# Altium schematic sheet LMT01 Interface.schdoc
size A4
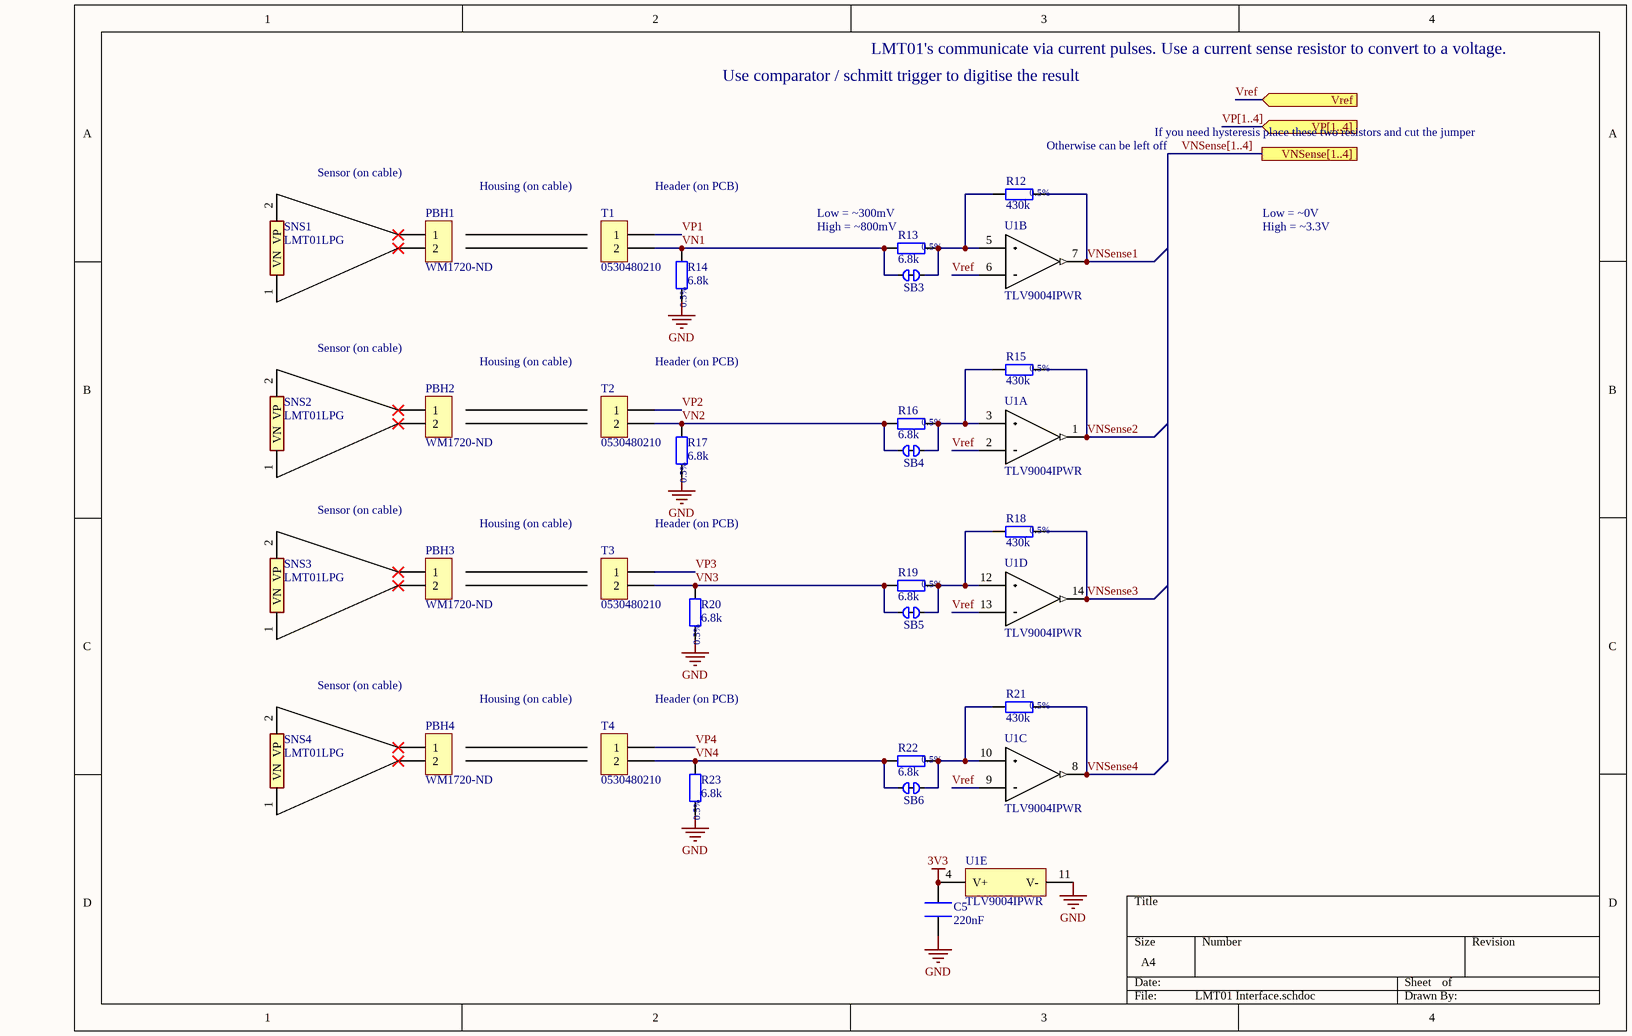
[diagram p0: LMT01 Interface.schdoc]

## Parts
C5  220nF  [CAPACITOR_0805_2012M-70N]
PBH1  MF Part No.: WM1720-ND  (hidden comment: 0530480210)  (mechanical)
PBH2  MF Part No.: WM1720-ND  (hidden comment: 0530480210)  (mechanical)
PBH3  MF Part No.: WM1720-ND  (hidden comment: 0530480210)  (mechanical)
PBH4  MF Part No.: WM1720-ND  (hidden comment: 0530480210)  (mechanical)
R12  430k  [Resistor_0805_2012M-50N]
R13  6.8k  [Resistor_0805_2012M-50N]
R14  6.8k  [Resistor_0805_2012M-50N]
R15  430k  [Resistor_0805_2012M-50N]
R16  6.8k  [Resistor_0805_2012M-50N]
R17  6.8k  [Resistor_0805_2012M-50N]
R18  430k  [Resistor_0805_2012M-50N]
R19  6.8k  [Resistor_0805_2012M-50N]
R20  6.8k  [Resistor_0805_2012M-50N]
R21  430k  [Resistor_0805_2012M-50N]
R22  6.8k  [Resistor_0805_2012M-50N]
R23  6.8k  [Resistor_0805_2012M-50N]
SB3  Solder Jumper Normally Closed 0201  [Solder Bridge Closed 0201]  (value not drawn)  (net tie, no BOM)
SB4  Solder Jumper Normally Closed 0201  [Solder Bridge Closed 0201]  (value not drawn)  (net tie, no BOM)
SB5  Solder Jumper Normally Closed 0201  [Solder Bridge Closed 0201]  (value not drawn)  (net tie, no BOM)
SB6  Solder Jumper Normally Closed 0201  [Solder Bridge Closed 0201]  (value not drawn)  (net tie, no BOM)
SNS1  LMT01LPG  [LPG0002A]  (mechanical)
SNS2  LMT01LPG  [LPG0002A]  (mechanical)
SNS3  LMT01LPG  [LPG0002A]  (mechanical)
SNS4  LMT01LPG  [LPG0002A]  (mechanical)
T1  0530480210  [MOLEX_0530480210]
T2  0530480210  [MOLEX_0530480210]
T3  0530480210  [MOLEX_0530480210]
T4  0530480210  [MOLEX_0530480210]
U1  TLV9004IPWR  [TSSOP65P640X120-14N]  (parts A,B,C,D,E of 5)

## Ports
VNSense[1..4], VP[1..4] (in), Vref (in)

## Nets
3V3: C5.2 U1.4(V+)
GND: C5.1 R14.1 R17.1 R20.1 R23.1 U1.11(V-)
VN1: R13.2 R14.2 SB3.2 T1.2
VN2: R16.2 R17.2 SB4.2 T2.2
VN3: R19.2 R20.2 SB5.2 T3.2
VN4: R22.2 R23.2 SB6.2 T4.2
VNSense1: R12.1 U1.7(OUT2)
VNSense2: R15.1 U1.1(OUT1)
VNSense3: R18.1 U1.14(OUT4)
VNSense4: R21.1 U1.8(OUT3)
VP1: T1.1
VP2: T2.1
VP3: T3.1
VP4: T4.1
Vref: U1.2(IN1-) U1.6(IN2-) U1.9(IN3-) U1.13(IN4-) ; port Vref
NetR12_2: R12.2 R13.1 SB3.1 U1.5(IN2+)
NetR15_2: R15.2 R16.1 SB4.1 U1.3(IN1+)
NetR18_2: R18.2 R19.1 SB5.1 U1.12(IN4+)
NetR21_2: R21.2 R22.1 SB6.1 U1.10(IN3+)

Not connected (* = marked no-connect by the designer): PBH1 1* 2*; PBH2 1* 2*; PBH3 1* 2*; PBH4 1* 2*; SNS1 1(VN) 2(VP); SNS2 1(VN) 2(VP); SNS3 1(VN) 2(VP); SNS4 1(VN) 2(VP)

## Buses and harness runs
bus VNSense[1..4] = port VNSense[1..4]
bus VP[1..4] = port VP[1..4]

## Notes on the sheet
- Use comparator / schmitt trigger to digitise the result
- LMT01's communicate via current pulses. Use a current sense resistor to convert to a voltage.
- (near SNS1) Sensor (on cable)
- (near R12) Otherwise can be left off
- If you need hysteresis place these two resistors and cut the jumper
- (near PBH1) Housing (on cable)
- (near T1) Header (on PCB)
- Low = ~300mV
- High = ~800mV
- Low = ~0V
- High = ~3.3V
- (near SNS2) Sensor (on cable)
- (near PBH2) Housing (on cable)
- (near T2) Header (on PCB)
- Sensor (on cable)
- (near PBH3) Housing (on cable)
- Header (on PCB)
- (near SNS4) Sensor (on cable)
- (near PBH4) Housing (on cable)
- (near T4) Header (on PCB)

## Library data of the parts
C5 = C0805C224K1RAC7800: Passive - Capacitor, X7R, 220nF Max, 100V, 0805 (2012 Metric), ±10%, -55°C ~ 85°C. 200nF @ 10V, 110nF @ 50V, 55nF @ 100V; APSS Standard Part: APSS Standard; Capacitance at Rated Voltage: 25%; Tolerance: ±10%; Temperature Coefficient: X7R; Rated Voltage: 100V; Temp Range: -55°C ~ 85°C; Package: 0805; Supplier 1: Digikey; Supplier 1 Part No.: 399-C0805C224K1RAC7800CT-ND; MF Part No.: C0805C224K1RAC7800; Value: 220nF
PBH1-PBH4 = 0530480210: Housing - Picoblade 02-pin, TH, RA; APSS Standard Part: APSS Standard; Pitch: 1.25mm; Pins: 2; Supplier 1: Digikey; Supplier 1 Part No.: 0510210200
R12 R15 R18 R21 = RG2012P-xxx-D-T5 Series: Passive - Resistor Series, 0805, 0.5%, 10 - 1M, E24, 0.063W, 1/8W, ±25ppm/°C, -55°C ~ 155°C, 0805 (2012 Metric); APSS Standard Part: APSS Standard; MF Part No.: RG2012P-434-D-T5; Value Range: 10 ~ 1M; Rated Voltage: 150V; Tolerance: 0.5%; Power: 1/8W; E Series: E24; Temp Range: -55°C ~ 155°C; Supplier 1: Digikey; Supplier 1 Part No.: RG2012P-434-D-T5-ND; Package: 0805; Temperature Coefficient: ±25ppm/°C; Value: 430k
R13 R14 R16 R17 R19 R20 R22 R23 = RG2012P-xxx-D-T5 Series: Passive - Resistor Series, 0805, 0.5%, 10 - 1M, E24, 0.063W, 1/8W, ±25ppm/°C, -55°C ~ 155°C, 0805 (2012 Metric); APSS Standard Part: APSS Standard; MF Part No.: RG2012P-682-D-T5; Value Range: 10 ~ 1M; Rated Voltage: 150V; Tolerance: 0.5%; Power: 1/8W; E Series: E24; Temp Range: -55°C ~ 155°C; Supplier 1: Digikey; Supplier 1 Part No.: RG2012P-682-D-T5-ND; Package: 0805; Temperature Coefficient: ±25ppm/°C; Value: 6.8k
SNS1-SNS4 = LMT01LPG: 0.5Â°C Accurate 2-pin Temperature Sensor with a Pulse Train Interface; Rated Voltage: 2V ~ 5.5V; MF Part No.: LMT01LPG; Package: TO-92-2; Supplier 1: Digikey; Supplier 1 Part No.: 296-42299-ND
T1-T4 = 0530480210: Header - Picoblade 02-pin, TH, RA; APSS Standard Part: APSS Standard; Pitch: 1.25mm; Mounting Type: Through-hole; Orientation: Right Angle; Pins: 2; Supplier 1: Digikey; Supplier 1 Part No.: 530480210; MF Part No.: 0530480210
U1 = TLV9004IPWR: IC - Opamp, Low Power, 4-Channel, 1MHz GBWP, RRIO, 1.8V to 5.5V, -40 to 125, 14-TSSOP; APSS Standard Part: APSS Standard; Temp Range: -40°C ~ 125°C; MF Part No.: TLV9004IPWR; Package: TSSOP-14; Supplier 1: Digikey; Supplier 1 Part No.: 296-51827-1-ND; Rated Voltage: 5.5V
SB3-SB6 = Solder Jumper Normally Closed 0201: DEBUG: DEBUG